# Altium schematic sheet 01 - Walter_IO.SchDoc
size A4
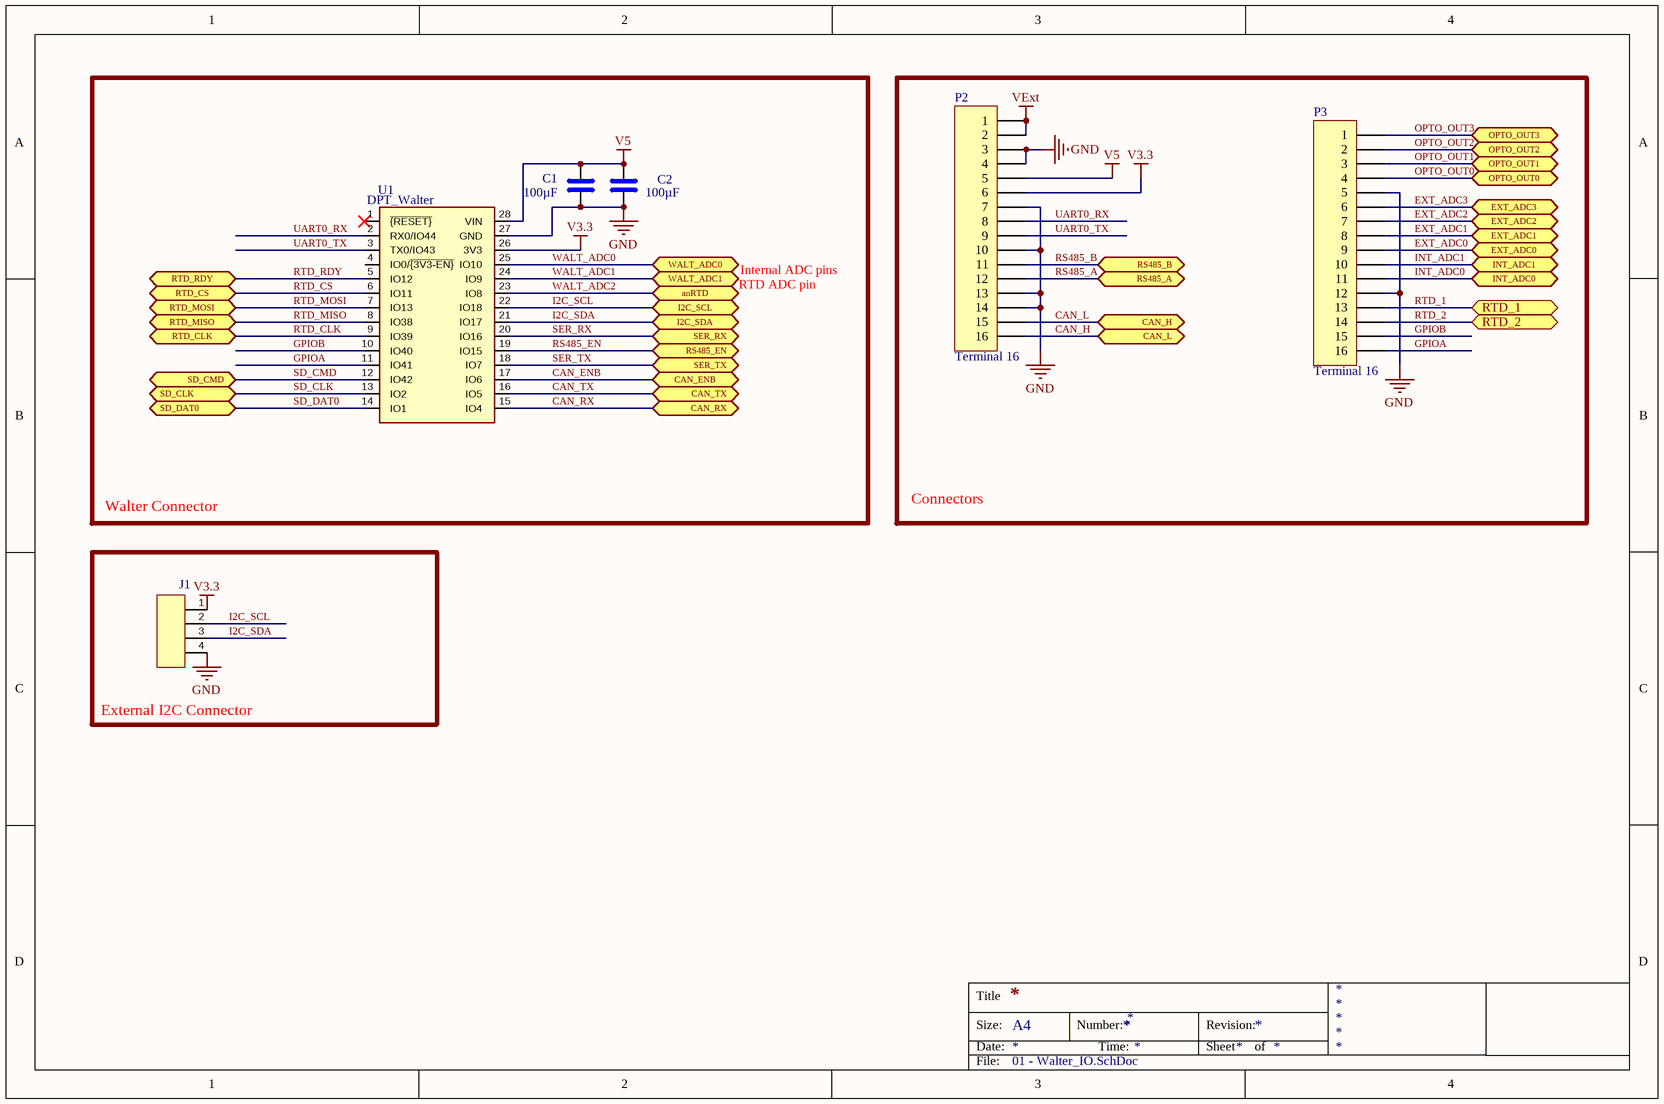
[diagram p0: 01 - Walter_IO.SchDoc]

## Parts
C1  100µF  [C_1210_3225Metric]
C2  100µF  [C_1210_3225Metric]
J1  Conn_01x04_Male  [PinHeader_1x04_P2.54mm_Vertical]  (value not drawn)
P2  Terminal 16  [CONN-TH_250-216]
P3  Terminal 16  [CONN-TH_250-216]
U1  value DPT_Walter  [walter-socket]  (hidden comment: DNP)

## Blocks framed on the sheet
Walter Connector: C1 C2 U1
Connectors: P2 P3
External I2C Connector: J1

## Ports
anRTD (bidir), CAN_ENB (bidir), CAN_H (bidir), CAN_L (bidir), CAN_RX (bidir), CAN_TX (bidir), EXT_ADC0 (bidir), EXT_ADC1 (bidir), EXT_ADC2 (bidir), EXT_ADC3 (bidir), I2C_SCL (bidir), I2C_SDA (bidir), INT_ADC0 (bidir), INT_ADC1 (bidir), OPTO_OUT0 (bidir), OPTO_OUT1 (bidir), OPTO_OUT2 (bidir), OPTO_OUT3 (bidir), RS485_A (bidir), RS485_B (bidir), RS485_EN (bidir), RTD_1 (bidir), RTD_2 (bidir), RTD_CLK (bidir), RTD_CS (bidir), RTD_MISO (bidir), RTD_MOSI (bidir), RTD_RDY (bidir), SD_CLK (bidir), SD_CMD (bidir), SD_DAT0 (bidir), SER_RX (bidir), SER_TX (bidir), WALT_ADC0 (bidir), WALT_ADC1 (bidir)

## Nets
GND: C1.2 C2.2 J1.4(Pin_4) P2.3 P2.4 P2.7 P2.10 P2.13 P2.14 P3.5 P3.12 U1.27(GND)
V3.3: J1.1(Pin_1) P2.6 U1.26(3V3)
V5: C1.1 C2.1 P2.5 U1.28(VIN)
VExt: P2.1 P2.2
CAN_ENB: U1.17(IO6) ; port CAN_ENB
CAN_H: P2.16 ; port CAN_L
CAN_L: P2.15 ; port CAN_H
CAN_RX: U1.15(IO4) ; port CAN_RX
CAN_TX: U1.16(IO5) ; port CAN_TX
EXT_ADC0: P3.9 ; port EXT_ADC0
EXT_ADC1: P3.8 ; port EXT_ADC1
EXT_ADC2: P3.7 ; port EXT_ADC2
EXT_ADC3: P3.6 ; port EXT_ADC3
GPIOA: P3.16 U1.11(IO41)
GPIOB: P3.15 U1.10(IO40)
I2C_SCL: J1.2(Pin_2) U1.22(IO18) ; port I2C_SCL
I2C_SDA: J1.3(Pin_3) U1.21(IO17) ; port I2C_SDA
INT_ADC0: P3.11 ; port INT_ADC0
INT_ADC1: P3.10 ; port INT_ADC1
OPTO_OUT0: P3.4 ; port OPTO_OUT0
OPTO_OUT1: P3.3 ; port OPTO_OUT1
OPTO_OUT2: P3.2 ; port OPTO_OUT2
OPTO_OUT3: P3.1 ; port OPTO_OUT3
RS485_A: P2.12 ; port RS485_A
RS485_B: P2.11 ; port RS485_B
RS485_EN: U1.19(IO15) ; port RS485_EN
RTD_1: P3.13 ; port RTD_1
RTD_2: P3.14 ; port RTD_2
RTD_CLK: U1.9(IO39) ; port RTD_CLK
RTD_CS: U1.6(IO11) ; port RTD_CS
RTD_MISO: U1.8(IO38) ; port RTD_MISO
RTD_MOSI: U1.7(IO13) ; port RTD_MOSI
RTD_RDY: U1.5(IO12) ; port RTD_RDY
SD_CLK: U1.13(IO2) ; port SD_CLK
SD_CMD: U1.12(IO42) ; port SD_CMD
SD_DAT0: U1.14(IO1) ; port SD_DAT0
SER_RX: U1.20(IO16) ; port SER_RX
SER_TX: U1.18(IO7) ; port SER_TX
UART0_RX: P2.8 U1.2(RX0/IO44)
UART0_TX: P2.9 U1.3(TX0/IO43)
WALT_ADC0: U1.25(IO10) ; port WALT_ADC0
WALT_ADC1: U1.24(IO9) ; port WALT_ADC1
WALT_ADC2: U1.23(IO8) ; port anRTD

Not connected (* = marked no-connect by the designer): U1 1(~{{RESET}}) 4(IO0/~{{3V3-EN}})

## Notes on the sheet
- RTD ADC pin
- Internal ADC pins
- Title
- Size:
- Date:
- A4
- Number:
- Time:
- Revision:
- Sheet
- of
- File:

## Library data of the parts
C1 C2 = C: 6.3V 100uF X5R ±20% 1210 Multilayer Ceramic Capacitors MLCC - SMD/SMT ROHS; JLCPCB: C49066; Value: 100µF; LCSC PART: C49066; lcsc link: https://www.lcsc.com/product-detail/Multilayer-Ceramic-Capacitors-MLCC-SMD-SMT_Samsung-Electro-Mechanics-CL32A107MQVNNNE_C49066.html?s_z=n_C49066
J1 = Conn_01x04_Male: 4P 2.54mm Single Row 1x4P Plugin,P=2.54mm Pin Headers ROHS; JLCPCB: C5116483; Value: Conn_01x04_Male; LCSC PART: C5116483; pdf: https://www.lcsc.com/product-detail/Pin-Headers_ZHOURI-2-54-1-4_C5116483.html?s_z=n_C5116483; lcsc link: https://www.lcsc.com/product-detail/Pin-Headers_ZHOURI-2-54-1-4_C5116483.html?s_z=n_C5116483
P2 P3 = Header 16: 3.5mm 1x16P -60℃~+105℃ 16P Gray 16 1 Plugin,P=3.5mm Spring Clamp System Terminal Block; LatestRevisionDate: 17-Jul-2002; LatestRevisionNote: Re-released for DXP Platform.; Publisher: Altium Limited; lcsc link: https://www.lcsc.com/product-detail/Spring-Clamp-System-Terminal-Block_WAGO-250-216_C2833595.html; LCSC PART: C2833595; JLCPCB: C2833595; pdf: https://www.lcsc.com/datasheet/lcsc_datasheet_2410121253_WAGO-250-216_C2833595.pdf; Value: Terminal 16
U1 = DPT_Walter